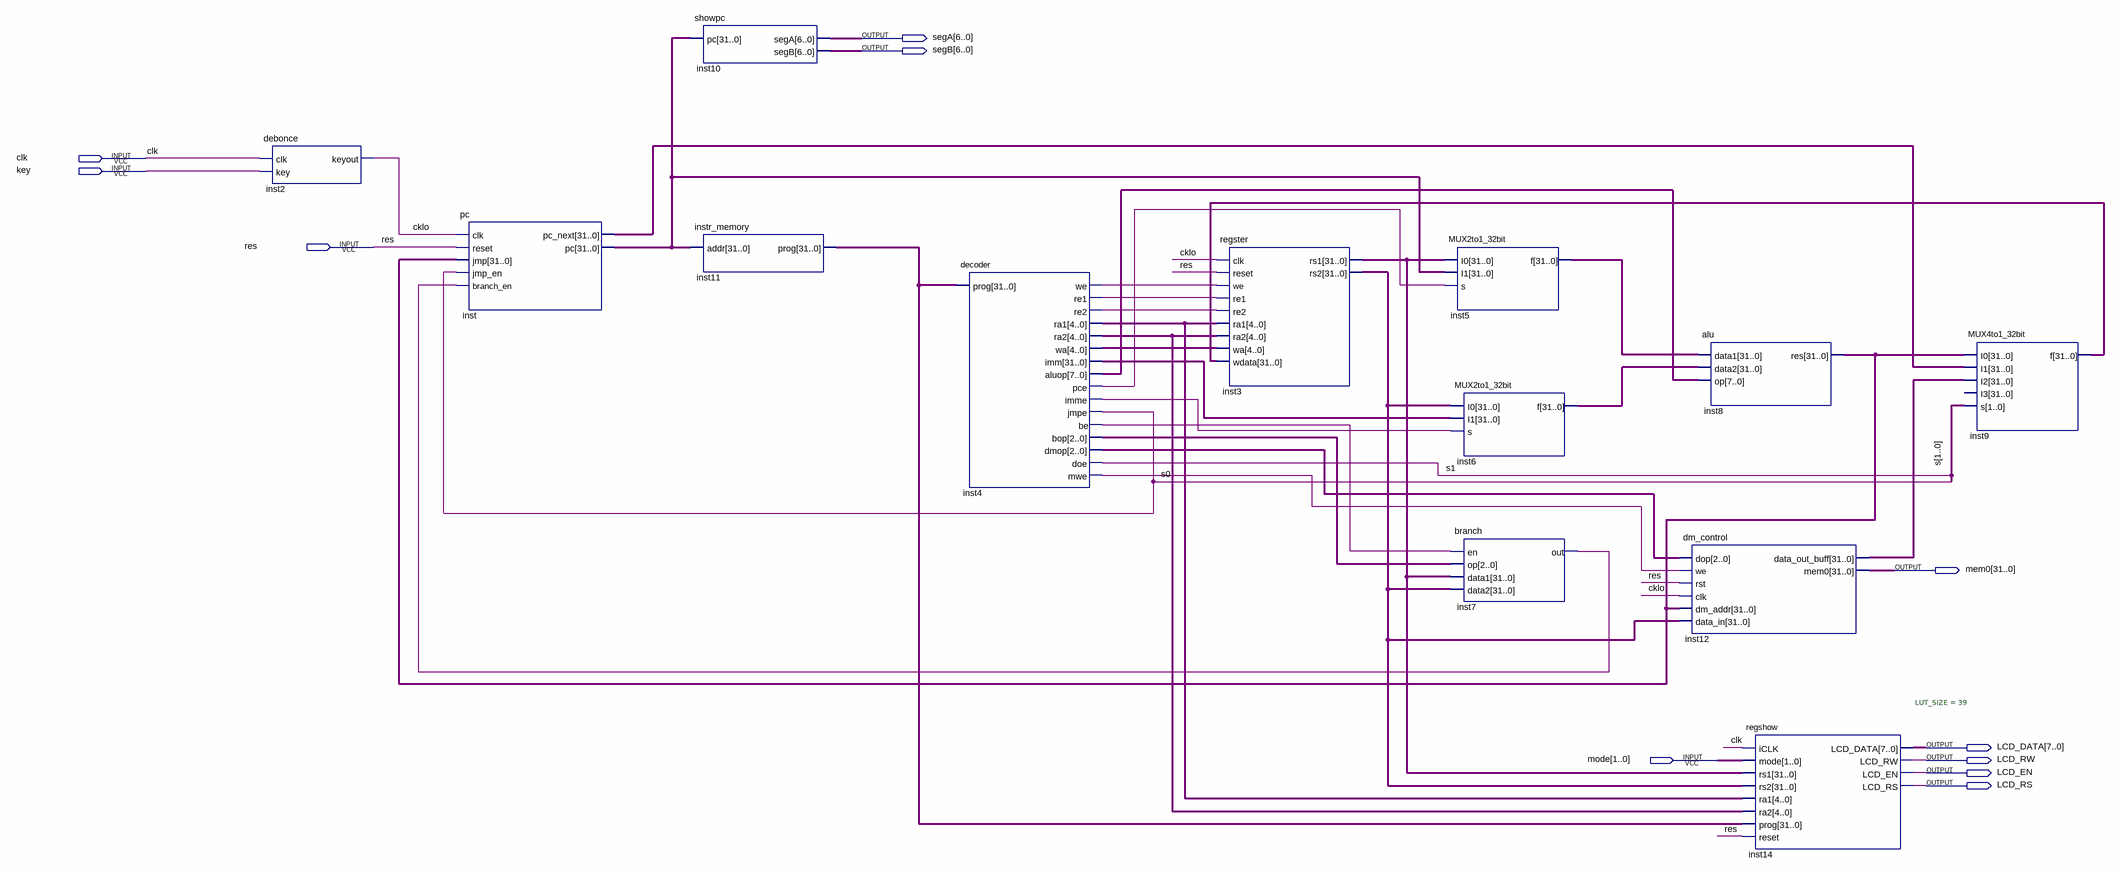
[diagram p0: schematic sheet]
// Quartus schematic rv32i.bdf as structural Verilog: 13 symbols, 11 pins
module rv32i (
  input  clk,
  input  key,
  input  res,
  input  [1:0] mode,
  output [6:0] segA,
  output [6:0] segB,
  output [31:0] mem0,
  output [7:0] LCD_DATA,
  output LCD_RW,
  output LCD_EN,
  output LCD_RS
);

  wire cklo, inst4_be, inst4_imme, inst4_mwe, inst4_pce, inst4_re1, inst4_re2, inst4_we, inst7_out;
  wire [1:0] s;
  wire [2:0] inst4_bop, inst4_dmop;
  wire [4:0] inst4_ra1, inst4_ra2, inst4_wa;
  wire [7:0] inst4_aluop;
  wire [31:0] inst3_rs1, inst3_rs2, inst4_imm, inst5_f, inst6_f, inst8_res, inst9_f, inst11_prog,
       inst12_data_out_buff, inst_pc, inst_pc_next;

  debonce inst2 (.clk(clk), .key(key), .keyout(cklo));
  pc inst (
    .clk(cklo), .reset(res), .jmp(inst8_res), .jmp_en(s[0]), .branch_en(inst7_out), .pc_next(inst_pc_next),
    .pc(inst_pc));
  showpc inst10 (.pc(inst_pc), .segA(segA), .segB(segB));
  instr_memory inst11 (.addr(inst_pc), .prog(inst11_prog));
  decoder inst4 (
    .prog(inst11_prog), .we(inst4_we), .re1(inst4_re1), .re2(inst4_re2), .ra1(inst4_ra1), .ra2(inst4_ra2),
    .wa(inst4_wa), .imm(inst4_imm), .aluop(inst4_aluop), .pce(inst4_pce), .imme(inst4_imme), .jmpe(s[0]),
    .be(inst4_be), .bop(inst4_bop), .dmop(inst4_dmop), .doe(s[1]), .mwe(inst4_mwe));
  regster inst3 (
    .clk(cklo), .reset(res), .we(inst4_we), .re1(inst4_re1), .re2(inst4_re2), .ra1(inst4_ra1),
    .ra2(inst4_ra2), .wa(inst4_wa), .wdata(inst9_f), .rs1(inst3_rs1), .rs2(inst3_rs2));
  MUX2to1_32bit inst5 (.I0(inst3_rs1), .I1(inst_pc), .s(inst4_pce), .f(inst5_f));
  MUX2to1_32bit inst6 (.I0(inst3_rs2), .I1(inst4_imm), .s(inst4_imme), .f(inst6_f));
  branch inst7 (.en(inst4_be), .op(inst4_bop), .data1(inst3_rs1), .data2(inst3_rs2), .out(inst7_out));
  alu inst8 (.data1(inst5_f), .data2(inst6_f), .op(inst4_aluop), .res(inst8_res));
  dm_control inst12 (
    .dop(inst4_dmop), .we(inst4_mwe), .rst(res), .clk(cklo), .dm_addr(inst8_res), .data_in(inst3_rs2),
    .data_out_buff(inst12_data_out_buff), .mem0(mem0));
  regshow #(.LUT_SIZE(39)) inst14 (
    .iCLK(clk), .mode(mode), .rs1(inst3_rs1), .rs2(inst3_rs2), .ra1(inst4_ra1), .ra2(inst4_ra2),
    .prog(inst11_prog), .reset(res), .LCD_DATA(LCD_DATA), .LCD_RW(LCD_RW), .LCD_EN(LCD_EN), .LCD_RS(LCD_RS));
  MUX4to1_32bit inst9 (.I0(inst8_res), .I1(inst_pc_next), .I2(inst12_data_out_buff), .s(s), .f(inst9_f));  // open: I3
endmodule
